# EAGLE schematic Xbee pcb (EAGLE 9.3.0)
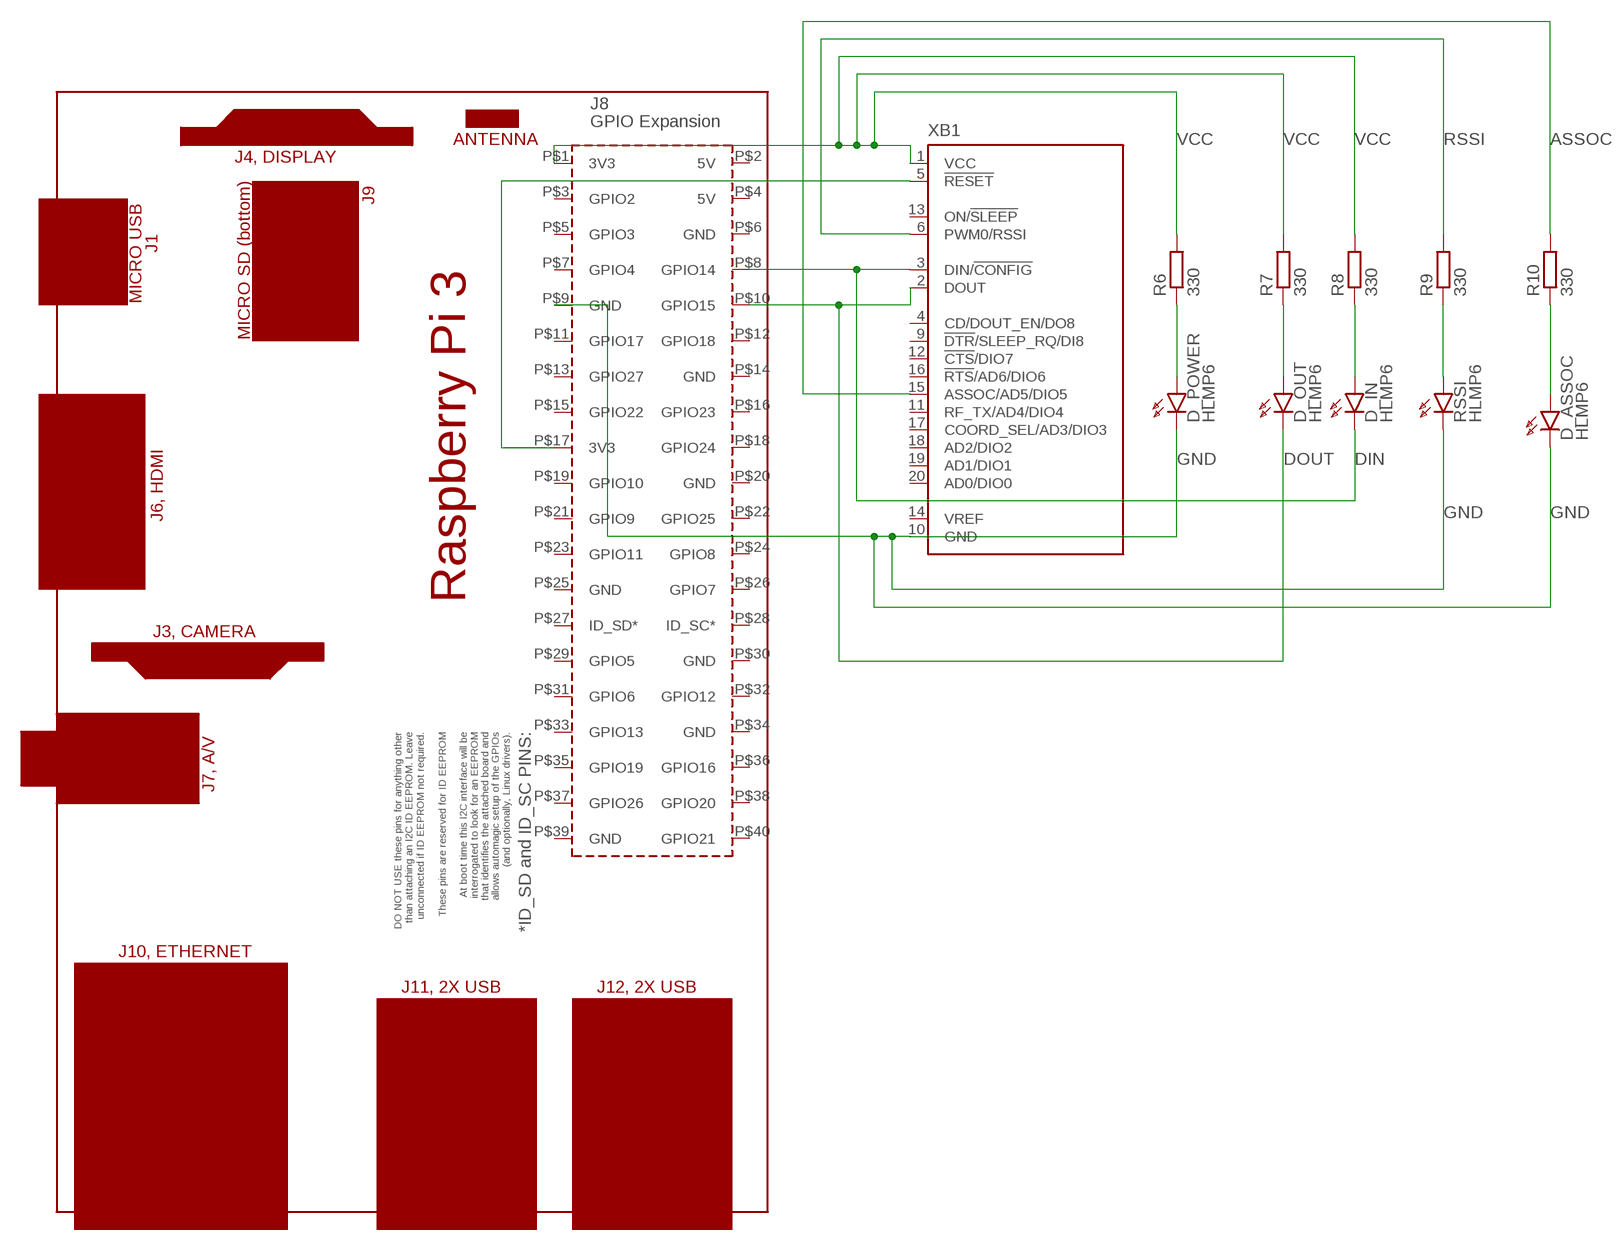
[diagram p0: schematic, sheet 1]

## Parts
D_ASSOC  HLMP6  [HLMP6]
D_IN  HLMP6  [HLMP6]
D_OUT  HLMP6  [HLMP6]
D_POWER  HLMP6  [HLMP6]
PCB1  RPI3RPI3  [RPI3]
R6  330  R-EU_0207/7  [0207/7]
R7  330  R-EU_0207/7  [0207/7]
R8  330  R-EU_0207/7  [0207/7]
R9  330  R-EU_0207/7  [0207/7]
R10  330  R-EU_0207/7  [0207/7]
RSSI  HLMP6  [HLMP6]
XB1  XBEE  [XBEE]

## Nets
ASSOC: R10.2 XB1.15(ASSOC/AD5/DIO5)
DIN: D_IN.K PCB1.P$8(GPIO14) XB1.3(DIN/!CONFIG)
DOUT: D_OUT.K PCB1.P$10(GPIO15) XB1.2(DOUT)
GND: D_ASSOC.K D_POWER.K PCB1.P$9(GND) RSSI.K XB1.10(GND)
N$5: PCB1.P$17(3V3) XB1.5(!RESET)
N$6: D_ASSOC.A R10.1
N$7: D_OUT.A R7.1
N$8: D_POWER.A R6.1
N$9: R9.1 RSSI.A
N$12: D_IN.A R8.1
RSSI: R9.2 XB1.6(PWM0/RSSI)
VCC: PCB1.P$1(3V3) R6.2 R7.2 R8.2 XB1.1(VCC)
Unconnected: PCB1.P$2(5V) PCB1.P$3(GPIO2) PCB1.P$4(5V) PCB1.P$5(GPIO3) PCB1.P$6(GND) PCB1.P$7(GPIO4) PCB1.P$11(GPIO17) PCB1.P$12(GPIO18) PCB1.P$13(GPIO27) PCB1.P$14(GND) PCB1.P$15(GPIO22) PCB1.P$16(GPIO23) PCB1.P$18(GPIO24) PCB1.P$19(GPIO10) PCB1.P$20(GND) PCB1.P$21(GPIO9) PCB1.P$22(GPIO25) PCB1.P$23(GPIO11) PCB1.P$24(GPIO8) PCB1.P$25(GND) PCB1.P$26(GPIO7) PCB1.P$27(ID_SD*) PCB1.P$28(ID_SC*) PCB1.P$29(GPIO5) PCB1.P$30(GND) PCB1.P$31(GPIO6) PCB1.P$32(GPIO12) PCB1.P$33(GPIO13) PCB1.P$34(GND) PCB1.P$35(GPIO19) PCB1.P$36(GPIO16) PCB1.P$37(GPIO26) PCB1.P$38(GPIO20) PCB1.P$39(GND) PCB1.P$40(GPIO21) XB1.4(CD/DOUT_EN/DO8) XB1.9(!DTR!/SLEEP_RQ/DI8) XB1.11(RF_TX/AD4/DIO4) XB1.12(!CTS!/DIO7) XB1.13(ON/!SLEEP) XB1.14(VREF) XB1.16(!RTS!/AD6/DIO6) XB1.17(COORD_SEL/AD3/DIO3) XB1.18(AD2/DIO2) XB1.19(AD1/DIO1) XB1.20(AD0/DIO0)

## Library data of the parts
D_ASSOC D_IN D_OUT D_POWER RSSI = display-hp:HLMP6: LED 2mm horizontal; MF: AGILENT TECHNOLOGIES; MPN: HLMP-6500; OC_FARNELL: 1652490; OC_NEWARK: 40K0088
PCB1 = e14_Rpi3_RevA+mirror-pcb:RPI3: Device for Raspberry Pi 3 board created by Dave Young for www.element14.com More information and support community is available at https://www.element14.com/community/community/raspberry-pi Device for Raspberry Pi 3 board updated by Gerald Schwarz for www.element14.com On RPI3 addet the layer milling and created a mirrored shield.
R6-R10 = rcl:R-EU_: RESISTOR, European symbol; SPICEPREFIX: R
XB1 = maxstream:XBEE: XBee (TM) /XBee-PRO(TM) OEM RF Modules Source: MaxStream, Inc. xbee_productmanual.pdf; MPN: XBP24-Z7UIT-004; OC_FARNELL: 1751799; OC_NEWARK: 34R5507

## Net classes
0 default: width 0.203 mm